# EAGLE schematic USB_JST-XH_Converter (EAGLE 9.6.2)

## Sheet 1 of 3
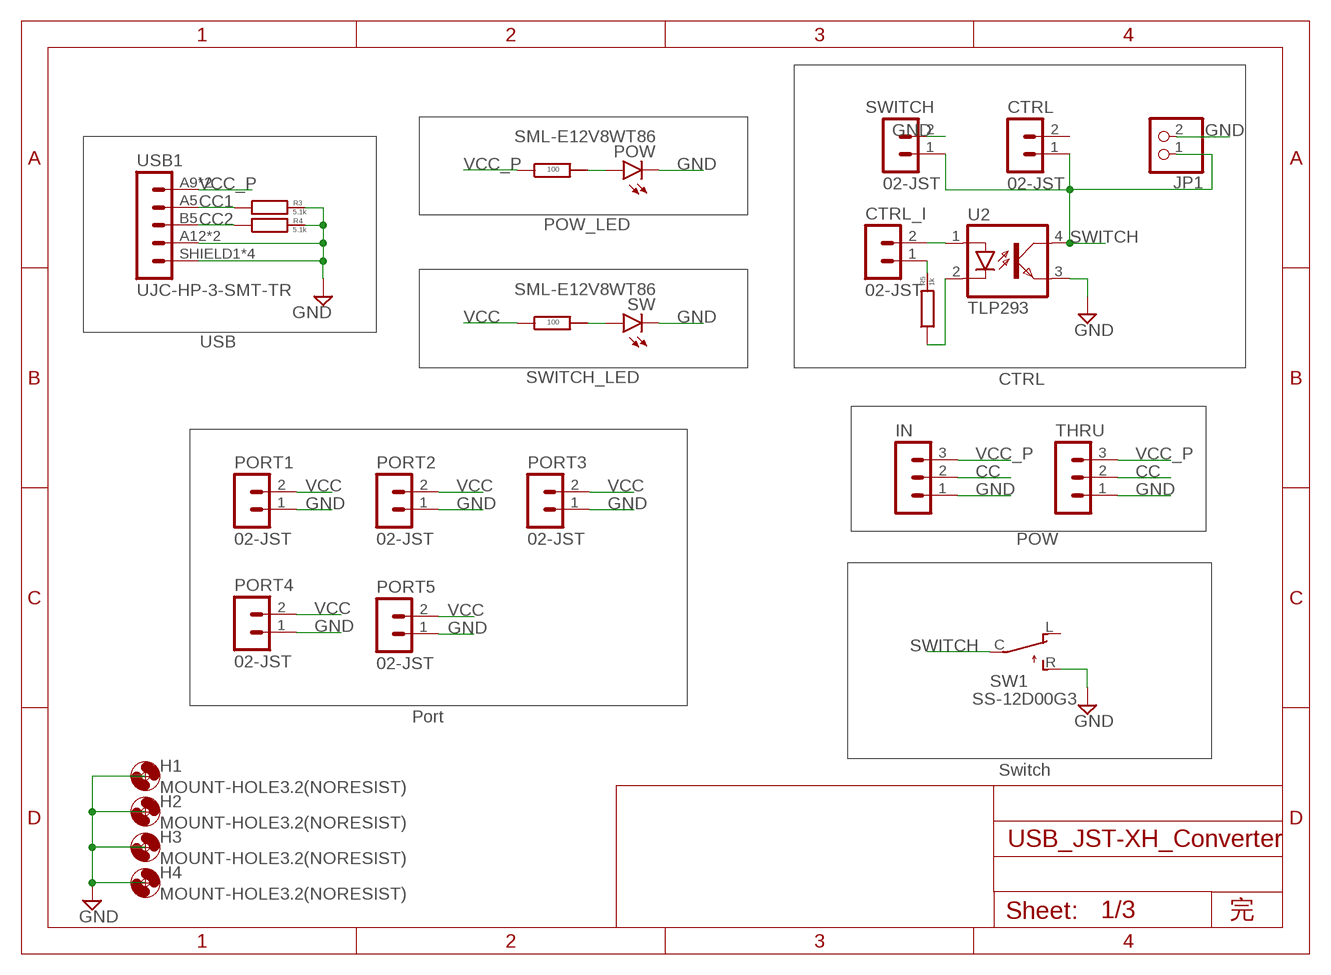
[diagram p0: schematic, sheet 1]

### Parts
CTRL  02-JST  [B2B-XH]
CTRL_I  02-JST  [B2B-XH]
H1  MOUNT-HOLE3.2(NORESIST)  [3,2]
H2  MOUNT-HOLE3.2(NORESIST)  [3,2]
H3  MOUNT-HOLE3.2(NORESIST)  [3,2]
H4  MOUNT-HOLE3.2(NORESIST)  [3,2]
IN  03-JST  [B3B-XH]
JP1  PINHD-1X2  [1X02]
PORT1  02-JST  [B2B-XH]
PORT2  02-JST  [B2B-XH]
PORT3  02-JST  [B2B-XH]
PORT4  02-JST  [B2B-XH]
PORT5  02-JST  [B2B-XH]
POW  SML-E12V8WT86  [SML-E12V8WT86]
R1  RG2012N-101-B-T5  [RG2012]
R2  RG2012N-101-B-T5  [RG2012]
R3  5.1k  RG2012  [RG2012]
R4  5.1k  RG2012  [RG2012]
R5  1k  RG2012  [RG2012]
SW  SML-E12V8WT86  [SML-E12V8WT86]
SW1  SS-12D00G3  [SS-12D00G3]
SWITCH  02-JST  [B2B-XH]
THRU  03-JST  [B3B-XH]
U2  TLP293  [SO4_TOS]
USB1  UJC-HP-3-SMT-TR  [UJC-HP-3-SMT-TR]

### Nets
CC: IN.2 THRU.2 ; also sheet 3
CC1: R3.LEFT USB1.A5(CC1) ; also sheet 3
CC2: R4.LEFT USB1.B5(CC2) ; also sheet 3
GND: H1.P$1 H2.P$1 H3.P$1 H4.P$1 IN.1 JP1.2 PORT1.1 PORT2.1 PORT3.1 PORT4.1 PORT5.1 POW.K(C) R3.RIGHT R4.RIGHT SW1.R SW.K(C) SWITCH.2 THRU.1 U2.3 USB1.A12(GND) USB1.B12(GND) USB1.SHIELD1(SHIELD) USB1.SHIELD2(SHIELD) USB1.SHIELD3(SHIELD) USB1.SHIELD4(SHIELD) ; also sheet 2,3
N$1: POW.A R1.LEFT
N$3: R2.LEFT SW.A
N$8: CTRL_I.2 U2.1
N$9: CTRL_I.1 R5.RIGHT
N$10: R5.LEFT U2.2
SWITCH: CTRL.1 JP1.1 SW1.C SWITCH.1 U2.4 ; also sheet 2
VCC: PORT1.2 PORT2.2 PORT3.2 PORT4.2 PORT5.2 R2.RIGHT ; also sheet 2
VCC_P: IN.3 R1.RIGHT THRU.3 USB1.A9(V-BUS) USB1.B9(V-BUS) ; also sheet 2,3
Unconnected: CTRL.2 SW1.L

### Notes on the sheet
- POW_LED
- USB
- SWITCH_LED | CTRL
- POW
- Port
- Switch
- 完

## Sheet 2 of 3
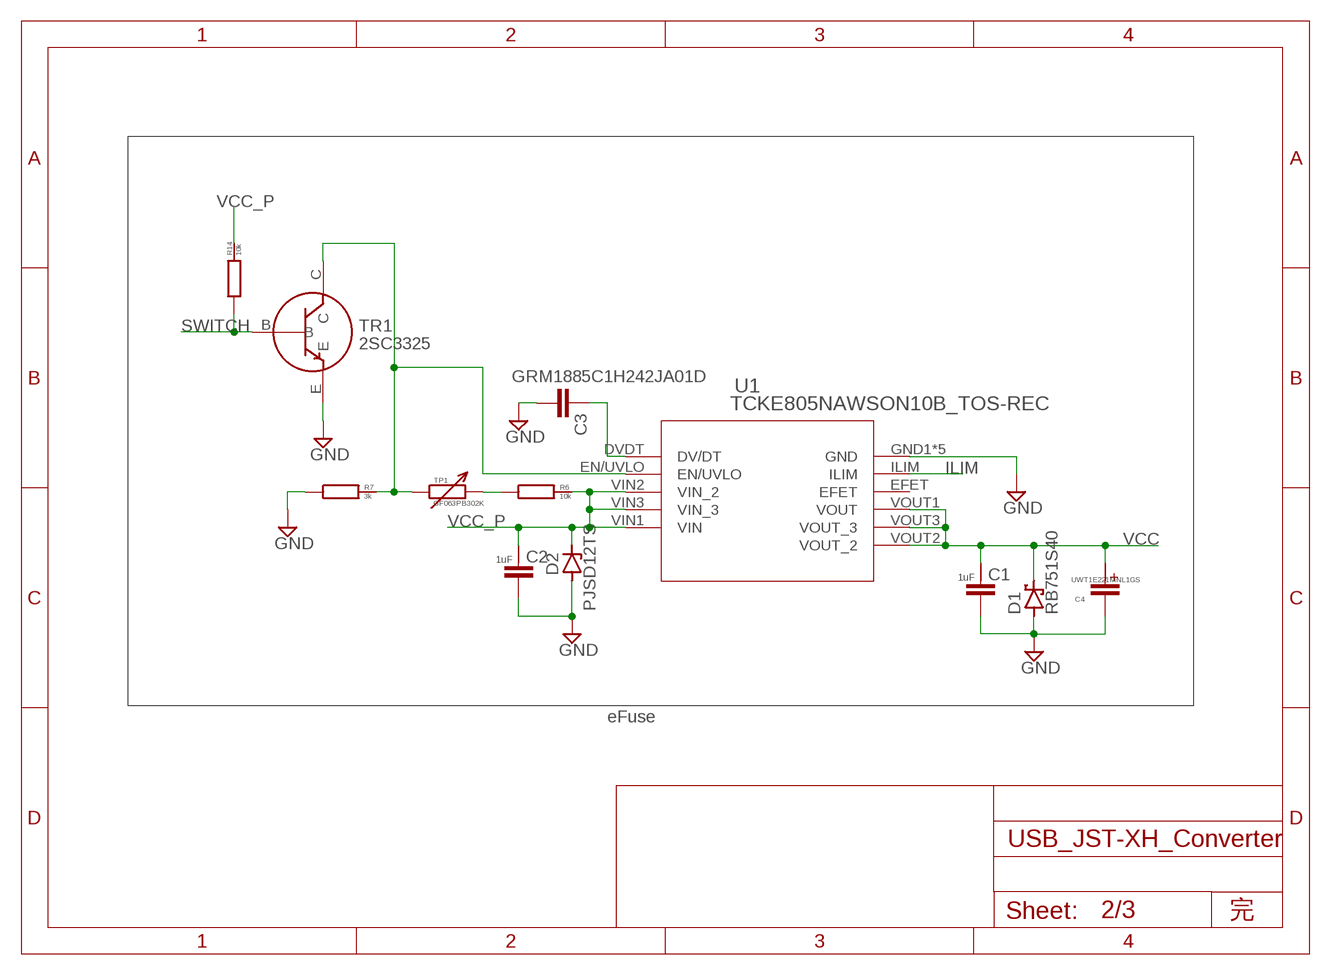
[diagram p1: schematic, sheet 2]

### Parts
C1  GRM21BC72A105KE01  [GRM21BC72A105KE01]
C2  GRM21BC72A105KE01  [GRM21BC72A105KE01]
C3  GRM1885C1H242JA01D  [GRM18]
C4  UWT1E221MNL1GS  [UWT1E221MNL1GS]
D1  RB751S40  [SOD-523]
D2  PJSD12TS  [SOD-523]
R6  10k  RG2012  [RG2012]
R7  3k  RG2012  [RG2012]
R14  10k  RG2012  [RG2012]
TP1  GF063PB302K  [GF063PB104K]
TR1  2SC3325  [2SC3325]
U1  TCKE805NAWSON10B_TOS-REC  [WSON10B_TOS-RIC]

### Nets
GND: C1.P$2 C2.P$2 C3.R C4.C(CATHODE) D1.A D2.A R7.LEFT TR1.E U1.GND1(GND) U1.GND2(GND) U1.GND3(GND) U1.GND4(GND) U1.GND5(GND) ; also sheet 1,3
ILIM: U1.ILIM ; also sheet 3
N$2: R7.RIGHT TP1.LEFT TR1.C U1.EN/UVLO
N$6: R6.LEFT TP1.CENTER(RIGHT) TP1.RIGHT
N$7: C3.L U1.DVDT(DV/DT)
SWITCH: R14.LEFT TR1.B ; also sheet 1
VCC: C1.P$1 C4.A(ANODE) D1.C U1.VOUT1(VOUT) U1.VOUT2(VOUT_2) U1.VOUT3(VOUT_3) ; also sheet 1
VCC_P: C2.P$1 D2.C R6.RIGHT R14.RIGHT U1.VIN1(VIN) U1.VIN2(VIN_2) U1.VIN3(VIN_3) ; also sheet 1,3
Unconnected: U1.EFET

### Notes on the sheet
- eFuse
- 完

## Sheet 3 of 3
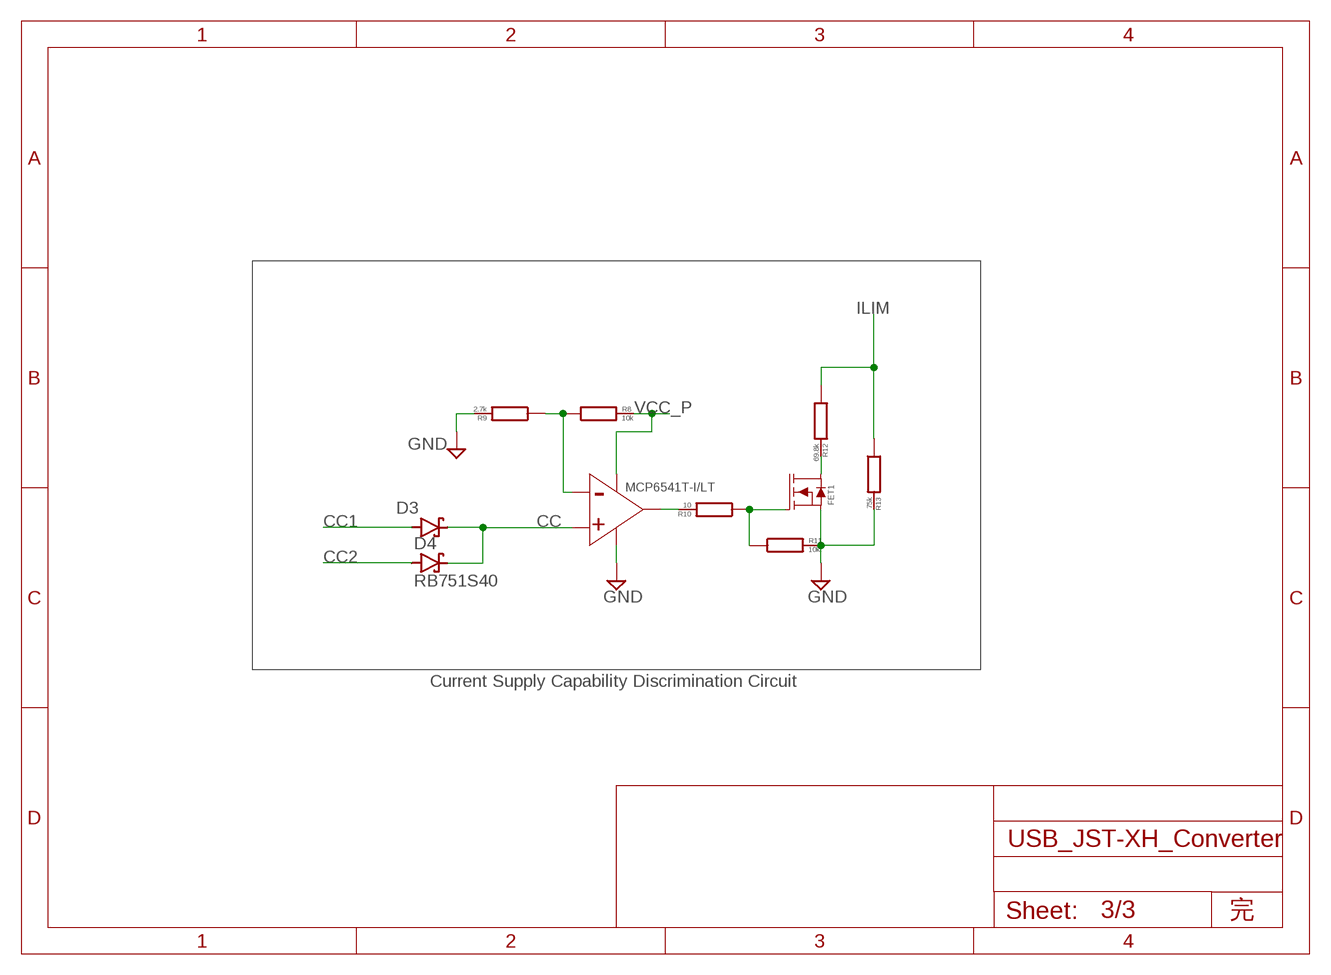
[diagram p2: schematic, sheet 3]

### Parts
COMP1  MCP6541T-I/LT  [SC-70-5]
D3  RB751S40  [SOD-523]
D4  RB751S40  [SOD-523]
FET1  BSS138  [SOT-23]
R8  10k  RG2012  [RG2012]
R9  2.7k  RG2012  [RG2012]
R10  10  RG2012  [RG2012]
R11  10k  RG2012  [RG2012]
R12  69.8k  RG2012  [RG2012]
R13  75k  RG2012  [RG2012]

### Nets
CC: COMP1.IN+ D3.C D4.C ; also sheet 1
CC1: D3.A ; also sheet 1
CC2: D4.A ; also sheet 1
GND: COMP1.VSS FET1.S R9.RIGHT R11.RIGHT R13.RIGHT ; also sheet 1,2
ILIM: R12.LEFT R13.LEFT ; also sheet 2
N$4: COMP1.IN- R8.LEFT R9.LEFT
N$5: FET1.G R10.LEFT R11.LEFT
N$12: COMP1.OUT R10.RIGHT
N$15: FET1.D R12.RIGHT
VCC_P: COMP1.VDD R8.RIGHT ; also sheet 1,2

### Notes on the sheet
- Current Supply Capability Discrimination Circuit
- 完

## Library data of the parts
C1 C2 = GRM21BC72A105KE01(1uF):GRM21BC72A105KE01
C3 = GRM1885C1H242JA01D:GRM1885C1H242JA01D
C4 = UWT1E221MNL1GS:UWT1E221MNL1GS
COMP1 = MCP6541T-I:MCP6541T-I/LT
CTRL CTRL_I PORT1-PORT5 SWITCH = con-jst-xh:02-JST: JST CONNECTOR
D1 D3 D4 = RB751S40:RB751S40
D2 = PJSD12TS:PJSD12TS
FET1 = BSS138:BSS138
H1-H4 = MOUNT-HOLE3.2(NORESIST):MOUNT-HOLE3.2(NORESIST)
IN THRU = con-jst-xh:03-JST: JST CONNECTOR
JP1 = pinhead:PINHD-1X2: PIN HEADER
POW SW = SML-E12V8WT86:SML-E12V8WT86
R1 R2 = RG2012N-101-B-T5:RG2012N-101-B-T5
R3-R14 = RG2012:RG2012
SW1 = SS-12D00G3:SS-12D00G3
TP1 = GF063P B104K:GF063PB302K
TR1 = 2SC3325:2SC3325
U1 = TCKE805NA:TCKE805NA
U2 = TLP293:TLP293; COPYRIGHT: Copyright (C) 2022 Ultra Librarian. All rights reserved.; MANUFACTURER_PART_NUMBER: TLP293; MFR_NAME: Toshiba Electronic Devices & Storage Corp.
USB1 = UJC-HP-3-SMT-TRv2:UJC-HP-3-SMT-TR